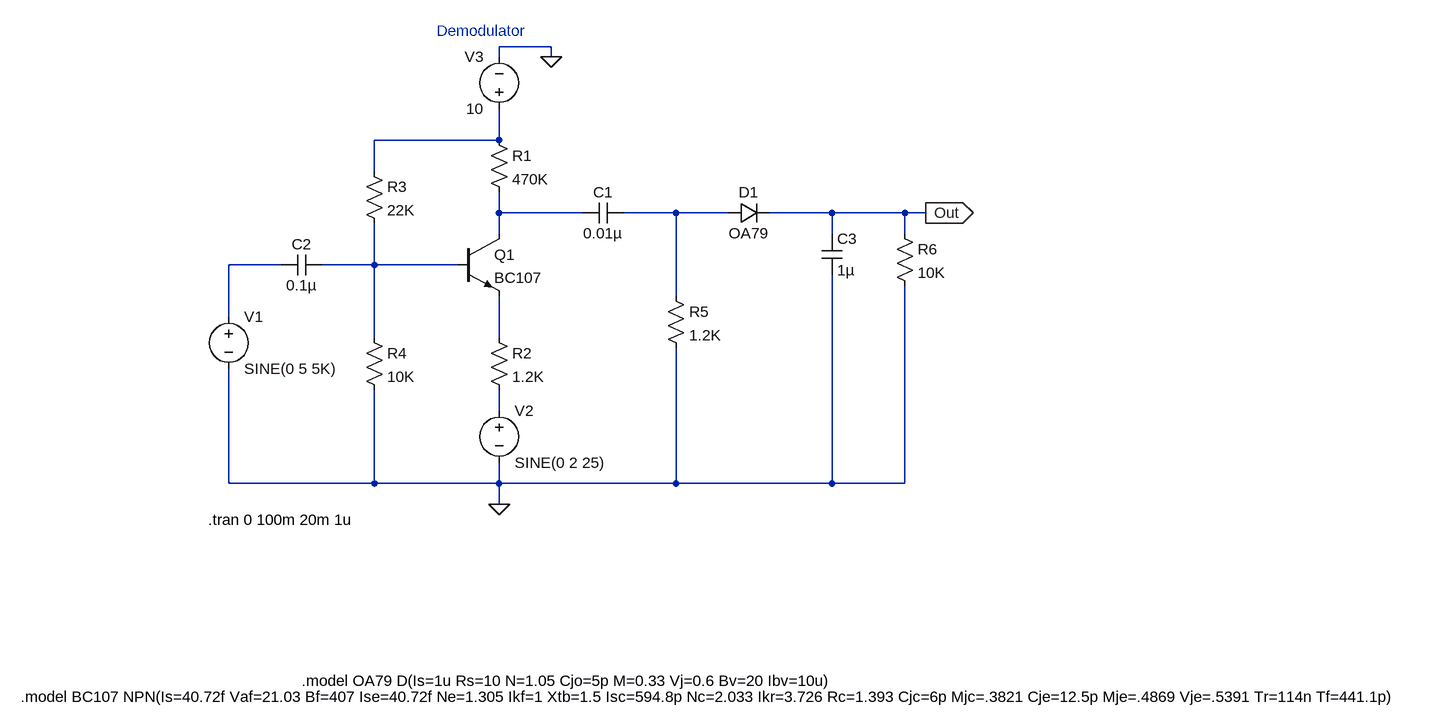
[diagram p0: schematic Demodulator.asc]
Demodulator.asc, the LTspice schematic file:
Version 4.1
SHEET 1 1744 872
WIRE 192 -144 112 -144
WIRE 112 -128 112 -144
WIRE 192 -128 192 -144
WIRE 112 0 112 -48
WIRE 112 0 -80 0
WIRE -80 48 -80 0
WIRE 112 112 112 80
WIRE 240 112 112 112
WIRE 384 112 304 112
WIRE 464 112 384 112
WIRE 624 112 528 112
WIRE 736 112 624 112
WIRE 768 112 736 112
WIRE 112 144 112 112
WIRE 624 144 624 112
WIRE 736 144 736 112
WIRE -224 192 -304 192
WIRE -80 192 -80 128
WIRE -80 192 -160 192
WIRE 48 192 -80 192
WIRE 384 240 384 112
WIRE -304 272 -304 192
WIRE -80 304 -80 192
WIRE 112 304 112 240
WIRE 112 416 112 384
WIRE -304 528 -304 352
WIRE -80 528 -80 384
WIRE -80 528 -304 528
WIRE 112 528 112 496
WIRE 112 528 -80 528
WIRE 384 528 384 320
WIRE 384 528 112 528
WIRE 624 528 624 208
WIRE 624 528 384 528
WIRE 736 528 736 224
WIRE 736 528 624 528
WIRE 112 560 112 528
FLAG 112 560 0
FLAG 192 -128 0
FLAG 768 112 Out
IOPIN 768 112 Out
SYMBOL npn 48 144 R0
SYMATTR InstName Q1
SYMATTR Value BC107
SYMBOL res 96 -16 R0
SYMATTR InstName R1
SYMATTR Value 470K
SYMBOL res 96 288 R0
SYMATTR InstName R2
SYMATTR Value 1.2K
SYMBOL res -96 32 R0
SYMATTR InstName R3
SYMATTR Value 22K
SYMBOL res -96 288 R0
SYMATTR InstName R4
SYMATTR Value 10K
SYMBOL res 368 224 R0
SYMATTR InstName R5
SYMATTR Value 1.2K
SYMBOL cap 304 96 R90
WINDOW 0 0 32 VBottom 2
WINDOW 3 32 32 VTop 2
SYMATTR InstName C1
SYMATTR Value 0.01µ
SYMBOL cap -160 176 R90
WINDOW 0 0 32 VBottom 2
WINDOW 3 32 32 VTop 2
SYMATTR InstName C2
SYMATTR Value 0.1µ
SYMBOL voltage -304 256 R0
WINDOW 123 0 0 Left 0
WINDOW 39 0 0 Left 0
SYMATTR InstName V1
SYMATTR Value SINE(0 5 5K)
SYMBOL voltage 112 400 R0
WINDOW 123 0 0 Left 0
WINDOW 39 0 0 Left 0
SYMATTR InstName V2
SYMATTR Value SINE(0 2 25)
SYMBOL voltage 112 -32 R180
WINDOW 0 24 96 Left 2
WINDOW 3 24 16 Left 2
SYMATTR InstName V3
SYMATTR Value 10
SYMBOL diode 464 128 R270
WINDOW 0 32 32 VTop 2
WINDOW 3 0 32 VBottom 2
SYMATTR InstName D1
SYMATTR Value OA79
SYMBOL cap 608 144 R0
SYMATTR InstName C3
SYMATTR Value 1µ
SYMBOL res 720 128 R0
SYMATTR InstName R6
SYMATTR Value 10K
TEXT -336 584 Left 2 !.tran 0 100m 20m 1u
TEXT 16 -168 Left 2 ;Demodulator
TEXT -192 832 Left 2 !.model OA79 D(Is=1u Rs=10 N=1.05 Cjo=5p M=0.33 Vj=0.6 Bv=20 Ibv=10u)
TEXT -624 856 Left 2 !.model BC107 NPN(Is=40.72f Vaf=21.03 Bf=407 Ise=40.72f Ne=1.305 Ikf=1 Xtb=1.5 Isc=594.8p Nc=2.033 Ikr=3.726 Rc=1.393 Cjc=6p Mjc=.3821 Cje=12.5p Mje=.4869 Vje=.5391 Tr=114n Tf=441.1p)

The netlist it stands for:
* Demodulator.asc
Q1 N002 N005 N006 0 BC107
R1 N001 N002 470K
R2 N006 N007 1.2K
R3 N001 N005 22K
R4 N005 0 10K
R5 N003 0 1.2K
C1 N003 N002 0.01µ
C2 N005 N004 0.1µ
V1 N004 0 SINE(0 5 5K)
V2 N007 0 SINE(0 2 25)
V3 N001 0 10
D1 N003 Out OA79
C3 Out 0 1µ
R6 Out 0 10K
.model D D
.lib standard.dio
.model NPN NPN
.model PNP PNP
.lib standard.bjt
.tran 0 100m 20m 1u
* Demodulator
.model OA79 D(Is=1u Rs=10 N=1.05 Cjo=5p M=0.33 Vj=0.6 Bv=20 Ibv=10u)
.model BC107 NPN(Is=40.72f Vaf=21.03 Bf=407 Ise=40.72f Ne=1.305 Ikf=1 Xtb=1.5 Isc=594.8p Nc=2.033 Ikr=3.726 Rc=1.393 Cjc=6p Mjc=.3821 Cje=12.5p Mje=.4869 Vje=.5391 Tr=114n Tf=441.1p)
.backanno
.end